# Altium schematic sheet Programmer.SchDoc
size Letter
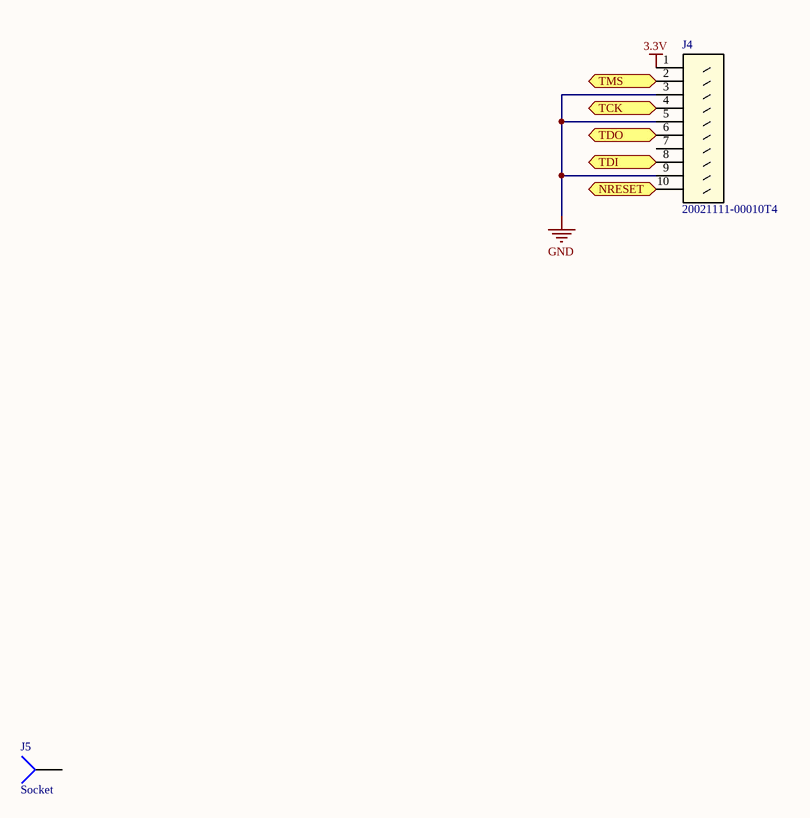
[diagram p0: Programmer.SchDoc]

## Parts
J4  20021111-00010T4  [CONN_MINITEK_2X5]
J5  Socket  [PIN1]

## Ports
NRESET (bidir), TCK (bidir), TDI (bidir), TDO (bidir), TMS (bidir)

## Nets
3.3V: J4.1
GND: J4.3 J4.5 J4.9
NRESET: J4.10 ; port NRESET
TCK: J4.4 ; port TCK
TDI: J4.8 ; port TDI
TDO: J4.6 ; port TDO
TMS: J4.2 ; port TMS

Not connected (* = marked no-connect by the designer): J4 7; J5 1

## Library data of the parts
J4 = 20021111-00010T4: Imported; Manufacturer_Part_Number: 20021111-00010T4LF; Vendor: FCI; C: Copyright (C) 2015 Accelerated Designs. All rights reserved; Copyright: Copyright (C) 2015 Accelerated Designs. All rights reserved; Value: Value; Type: Type; RefDes: RefDes
J5 = Socket: LatestRevisionDate: 17-Jul-2002; LatestRevisionNote: Re-released for DXP Platform.; Publisher: Altium Limited